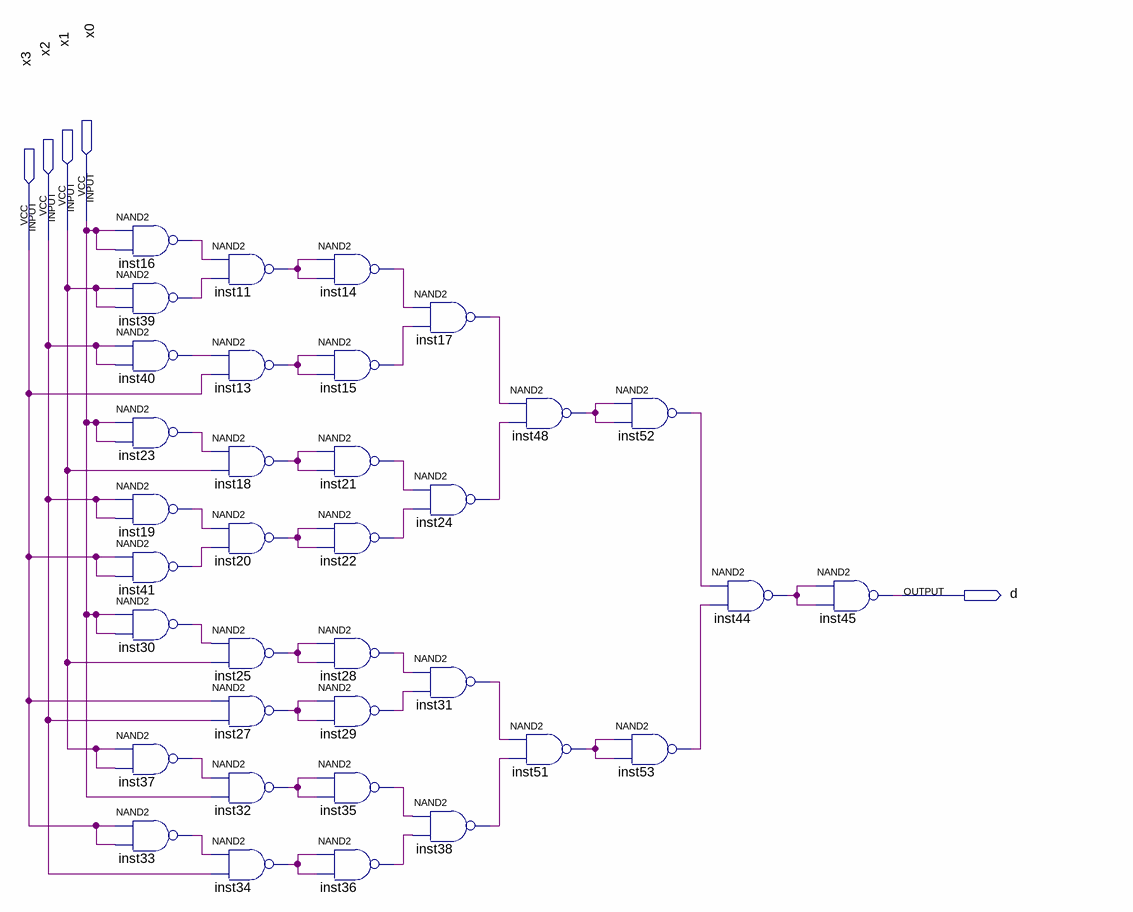
[diagram p0: schematic sheet]
// Quartus schematic DZ1_Quartus_D.bdf as structural Verilog: 35 symbols, 5 pins
module DZ1_Quartus_D (
  input  x0,
  input  x1,
  input  x2,
  input  x3,
  output d
);

  wire inst11_out, inst13_out, inst14_out, inst15_out, inst16_out, inst17_out, inst18_out, inst19_out,
       inst20_out, inst21_out, inst22_out, inst23_out, inst24_out, inst25_out, inst27_out, inst28_out,
       inst29_out, inst30_out, inst31_out, inst32_out, inst33_out, inst34_out, inst35_out, inst36_out,
       inst37_out, inst38_out, inst39_out, inst40_out, inst41_out, inst44_out, inst48_out, inst51_out,
       inst52_out, inst53_out;

  nand inst16 (inst16_out, x0, x0);
  nand inst39 (inst39_out, x1, x1);
  nand inst40 (inst40_out, x2, x2);
  nand inst23 (inst23_out, x0, x0);
  nand inst19 (inst19_out, x2, x2);
  nand inst41 (inst41_out, x3, x3);
  nand inst30 (inst30_out, x0, x0);
  nand inst37 (inst37_out, x1, x1);
  nand inst33 (inst33_out, x3, x3);
  nand inst11 (inst11_out, inst16_out, inst39_out);
  nand inst13 (inst13_out, inst40_out, x3);
  nand inst18 (inst18_out, inst23_out, x1);
  nand inst20 (inst20_out, inst19_out, inst41_out);
  nand inst25 (inst25_out, inst30_out, x1);
  nand inst27 (inst27_out, x3, x2);
  nand inst32 (inst32_out, inst37_out, x0);
  nand inst34 (inst34_out, inst33_out, x2);
  nand inst14 (inst14_out, inst11_out, inst11_out);
  nand inst15 (inst15_out, inst13_out, inst13_out);
  nand inst21 (inst21_out, inst18_out, inst18_out);
  nand inst22 (inst22_out, inst20_out, inst20_out);
  nand inst28 (inst28_out, inst25_out, inst25_out);
  nand inst29 (inst29_out, inst27_out, inst27_out);
  nand inst35 (inst35_out, inst32_out, inst32_out);
  nand inst36 (inst36_out, inst34_out, inst34_out);
  nand inst17 (inst17_out, inst14_out, inst15_out);
  nand inst24 (inst24_out, inst21_out, inst22_out);
  nand inst31 (inst31_out, inst28_out, inst29_out);
  nand inst38 (inst38_out, inst35_out, inst36_out);
  nand inst48 (inst48_out, inst17_out, inst24_out);
  nand inst51 (inst51_out, inst31_out, inst38_out);
  nand inst52 (inst52_out, inst48_out, inst48_out);
  nand inst53 (inst53_out, inst51_out, inst51_out);
  nand inst44 (inst44_out, inst52_out, inst53_out);
  nand inst45 (d, inst44_out, inst44_out);
endmodule
